# Altium schematic sheet chicker.SchDoc
size A4; SheetNumber: 7
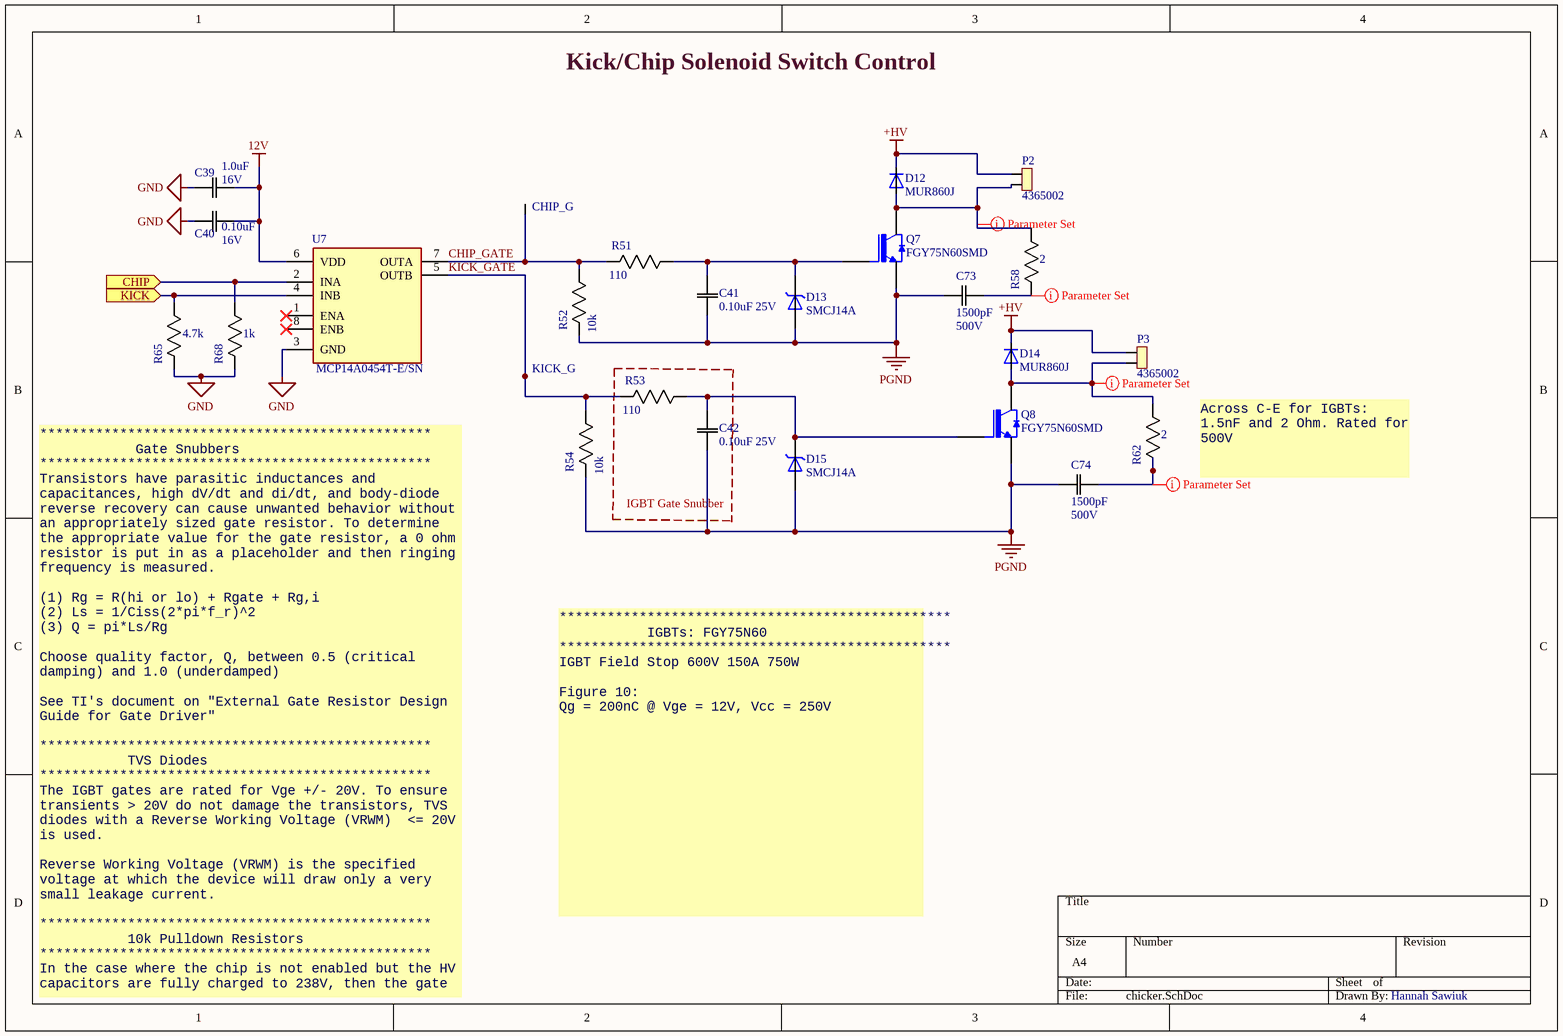
[diagram p0: chicker.SchDoc]

## Parts
C39  Rating: 16V  [0603]  (hidden comment: 1.0uF)
C40  Rating: 16V  [0603]  (hidden comment: 0.10uF)
C41  0.10uF 25V  [0805]
C42  0.10uF 25V  [0805]
C73  Rating: 500V  [0805]  (hidden comment: 1500pF)
C74  Rating: 500V  [0805]  (hidden comment: 1500pF)
CHIP_G  Test Point (Via)  [TP]  (value not drawn)  (no BOM)
D12  MUR860J  [DO-214AB-DIODES]
D13  SMCJ14A  [DIOM7959X262N]
D14  MUR860J  [DO-214AB-DIODES]
D15  SMCJ14A  [DIOM7959X262N]
KICK_G  Test Point (Via)  [TP]  (value not drawn)  (no BOM)
P2  4365002  [43650-02]
P3  4365002  [43650-02]
Q7  FGY75N60SMD  [TO-247-3 - FaceDown]
Q8  FGY75N60SMD  [TO-247-3 - FaceDown]
R51  110  [0603]
R52  10k  [0603]
R53  110  [0603]
R54  10k  [0603]
R58  2  [0603]
R62  2  [0603]
R65  4.7k  [0603]
R68  1k  [0603]
U7  MCP14A0454T-E/SN  [8-SOIC]

## Ports
CHIP (in), KICK (in)

## Nets
12V: C39.2(C2) C40.2(C2) U7.6(VDD)
+HV: D12.1(C) D14.1(C) P2.2 P3.2
GND: C39.1(C1) C40.1(C1) R65.2(R2) R68.2(R2) U7.3(GND)
PGND: C41.1(C1) C42.1(C1) C73.2(C2) C74.2(C2) D13.A D15.A Q7.3(E) Q8.3(E) R52.2(R2) R54.2(R2)
CHIP: R68.1(R1) U7.2(INA) ; port CHIP
CHIP_GATE: CHIP_G.1 R51.2(R2) R52.1(R1) U7.7(OUTA)
KICK: R65.1(R1) U7.4(INB) ; port KICK
KICK_GATE: KICK_G.1 R53.2(R2) R54.1(R1) U7.5(OUTB)
NetC41_2: C41.2(C2) D13.C Q7.1(G) R51.1(R1)
NetC42_2: C42.2(C2) D15.C Q8.1(G) R53.1(R1)
NetC73_1: C73.1(C1) R58.2(R2)
NetC74_1: C74.1(C1) R62.2(R2)
NetD12_2: D12.2(A) P2.1 Q7.2(C) R58.1(R1)
NetD14_2: D14.2(A) P3.1 Q8.2(C) R62.1(R1)

Not connected (* = marked no-connect by the designer): U7 1(ENA)* 8(ENB)*

## Layout directives
net class HighVoltage: NetC73_1, NetC74_1, NetD12_2, NetD14_2

## Notes on the sheet
- Kick/Chip Solenoid Switch Control
- IGBT Gate Snubber
- Across C-E for IGBTs: 1.5nF and 2 Ohm. Rated for 500V
- *************************************************
  IGBTs: FGY75N60
  *************************************************
  IGBT Field Stop 600V 150A 750W
  Figure 10:
  Qg = 200nC @ Vge = 12V, Vcc = 250V
- *************************************************
  Gate Snubbers
  *************************************************
  Transistors have parasitic inductances and capacitances, high dV/dt and di/dt, and body-diode reverse recovery can cause unwanted behavior without an appropriately sized gate resistor. To determine the appropriate value for the gate resistor, a 0 ohm resistor is put in as a placeholder and then ringing frequency is measured.
  (1) Rg = R(hi or lo) + Rgate + Rg,i
  (2) Ls = 1/Ciss(2*pi*f_r)^2
  (3) Q = pi*Ls/Rg
  Choose quality factor, Q, between 0.5 (critical damping) and 1.0 (underdamped)
  See TI's document on "External Gate Resistor Design Guide for Gate Driver"
  *************************************************
  TVS Diodes
  *************************************************
  The IGBT gates are rated for Vge +/- 20V. To ensure transients > 20V do not damage the transistors, TVS diodes with a Reverse Working Voltage (VRWM)  <= 20V is used.
  Reverse Working Voltage (VRWM) is the specified voltage at which the device will draw only a very small leakage current.
  *************************************************
  10k Pulldown Resistors
  *************************************************
  In the case where the chip is not enabled but the HV capacitors are fully charged to 238V, then the gate of the IGBTs would be floating, and there could be the case where the gate rises above 12V, turning the IGBTs on. This could lead to a safety hazard due to the uncontrolled kicker/chipper action. By pulling down the gates with a 10k resistor, the IGBTs will remain off whenever the gate driver is not enabled.
- Hannah Sawiuk

## Library data of the parts
C39 = CAP 1.0uF 16V: CAP CER 1.0UF 16V X5R 0603/0805; Tolerance: 10%; Package: 0603/0805; Temperature Coefficient: X5R; Operating Temperature: -55°C ~ 85°C; Value: 1.0uF; Part Number: CAP 1.0uF 16V
C40 = CAP 0.10uF 16V: CAP CER 0.10UF 16V X5R 0603; Tolerance: 10%; Temperature Coefficient: X5R; Value: 0.10uF; Part Number: CAP 0.10uF 16V; Package: 0603/0805; Operating Temperature: -55°C ~ 85°C
C41 C42 = CAP 0.10uF 25V: CAP CER 0.10UF 25V X7R 0805; Tolerance: 10%; Value: 0.10uF; Temperature Coefficient: X7R; Rating: 25V; Operating Temperature: -55°C ~ 125°C; Part Number: CAP 0.10uF 25V
C73 C74 = CAP 1500pF 500V - 0805: Default Symbol for Capacitors; Temperature Coefficient: X7R; Value: 1500pF; Part Number: CAP 1500pF 500V - 0805
D12 D14 = DIODE FAST 600V 8A: Diode Standard 600 V 8A Surface Mount SMC; ComponentLink1Description: Octopart Link; ComponentLink1URL: https://octopart.com/search?q=MUR860J&currency=USD&specs=0; Supplier 1: Digi-Key; Supplier Part Number 1: 1740-MUR860JCT-ND; Part Number: DIODE FAST 600V 8A; Manufacturer Part Number 1: MUR860J; Supplier URL 1: https://www.digikey.com/en/products/detail/ween-semiconductors/MUR860J/11630078
D13 D15 = DIODE TVS 14VR 15.6VBR: 23.2V Clamp 64.7A Ipp Tvs Diode Surface Mount DO-214AB (SMC), VR = 14V, VBR = 15.6V; Package: None; Price: None; Value: *; MP: SMCJ14A; Availability: Unavailable; Supplier 1: Digi-Key; Supplier 2: Mouser; Supplier Part Number 1: SMCJ14ALFCT-ND; Supplier Part Number 2: 652-SMCJ14A; Part Number: DIODE TVS 14VR 15.6VBR; Manufacturer Part Number 1: SMCJ14A; Supplier URL 1: https://www.digikey.com/en/products/detail/littelfuse-inc/SMCJ14A/762380
P2 P3 = CN MOLEX 4365002XX: MOLEX MICROFIT 2CKT RIGHT THRU; MF: MOLEX; MP: 4365002XX; Digikey: WM17581-ND; Digikey Link: https://www.digikey.com/en/products/detail/molex/0436500205/3310532?s=N4IgTCBcDaICwGYBsBWADGsaUgLoF8g; Package: Microfit; Price: 1.44 CAD; Value: N/A; Supplier 1: Digi-Key; Part Number: CN MOLEX 4365002XX; Supplier URL 1: https://www.digikey.com/en/products/detail/molex/0436500205/3310532?s=N4IgTCBcDaICwGYBsBWADGsaUgLoF8g; Pin Count: 2
Q7 Q8 = FGY75N60SMD: IGBT Field Stop 600V 150A 750W Through Hole PowerTO-247-3; MF: ON Semiconductor; Package: TO-247 Fairchild Semiconductor; MP: FGY75N60SMD; Supplier 1: Digi-Key; Supplier Part Number 1: FGY75N60SMDFS-ND; Part Number: FGY75N60SMD
R51 R53 = RES 110.0 1/8W - 1%: RES SMD 110 OHM 1% 1/8W 0603; Manufacturer Part Number 1: RMCF0603FT110R; Power (Watts): 0.125W; Package: 0603; Value: 110; Tolerance: 1%; Part Number: RES 110.0 1/8W - 1%; Supplier 1: Digi-Key; Supplier Part Number 1: RMCF0603FT110RCT-ND; Supplier URL 1: https://www.digikey.ca/en/products/detail/stackpole-electronics-inc/RMCF0603FT110R/1761268
R52 R54 = RES 10k 1/8W - 1%: RES SMD 10K OHM 1% 1/8W 0603; Manufacturer Part Number 1: ERJ-H3GJ103V; Power (Watts): 0.125W; Tolerance: 5%; Package: 0805; Value: 10k; Part Number: RES 10k 1/8W - 1%; Supplier 1: Digi-Key; Supplier Part Number 1: 10-ERJ-H3GJ103VCT-ND; Supplier URL 1: https://www.digikey.ca/en/products/detail/panasonic-electronic-components/ERJ-H3GJ103V/13877876?s=N4IgTCBcDaIIwAYC0BRASgKSQCQMwHENFcA1AYQBUkA5AERAF0BfIA; Manufacturer Part Number 2: RMCF0805JT10K0; Supplier 2: Digi-Key; Supplier Part Number 2: RMCF0805JT10K0CT-ND; Supplier URL 2: https://www.digikey.ca/en/products/detail/stackpole-electronics-inc/RMCF0805JT10K0/1757762?s=N4IgTCBcDaIEoFkDCAxADADjQVgFIBUBGNAaTSXxAF0BfIA; Tolerance 2: 5%
R58 R62 = RES 2.0 1/8W: Default Resistor Symbol; Power (Watts): 0.125W; Tolerance: 5%; Package: 0805; Value: 2; Part Number: RES 2.0 1/8W
R65 = RES 4.7k 1/8W - 5%: Default Resistor Symbol; Manufacturer Part Number 1: RMCF0603JT4K70; Power (Watts): 0.125W; Tolerance: 5%; Package: 0805; Value: 4.7k; Part Number: RES 4.7k 1/8W - 5%; Supplier 1: Digi-Key; Supplier Part Number 1: RMCF0603JT4K70CT-ND; Supplier URL 1: https://www.digikey.ca/en/products/detail/stackpole-electronics-inc/RMCF0603JT4K70/1757976
R68 = RES 1k 1/8W: Default Resistor Symbol; Manufacturer Part Number 1: MCT06030C1001FP500; Power (Watts): 0.125W; Tolerance: 1%; Package: 0805; Value: 1k; Part Number: RES 1k 1/8W; Supplier 1: Digi-Key; Supplier Part Number 1: MCT0603-1.00K-CFCT-ND; Supplier URL 1: https://www.digikey.ca/en/products/detail/vishay-beyschlag-draloric-bc-components/MCT06030C1001FP500/2607821?s=N4IgTCBcDaILIGEAqAGAbCgzAWgIwDoUUBpbBAMWWwDkAREAXQF8g
U7 = MCP14A0454T-E_SN: IC GATE DRVR LOW-SIDE 8SOIC; Supplier 1: Digi-key; Supplier Part Number 1: MCP14A0454T-E/SNCT-ND; Part Number: MCP14A0454T-E_SN; Manufacturer Part Number 1: MCP14A0454T-E/SN; Supplier URL 1: https://www.digikey.com/en/products/detail/microchip-technology/MCP14A0454T-E-SN/8639009?s=N4IgTCBcDaILIGEAKBGALAQQAxoKxoBUBaAUQHoBlAORAF0BfIA
CHIP_G KICK_G = Test Point (Via): Part Number: Test Point (Via)